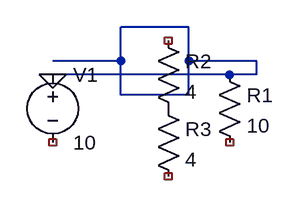
[diagram p0: schematic ltspice_edit.asc]
ltspice_edit.asc, the LTspice schematic file:
Version 4
SHEET 1 880 680
WIRE 208 72 128 72
WIRE 128 112 128 72
WIRE 128 112 48 112
WIRE 208 112 208 72
WIRE 288 112 208 112
WIRE 256 128 48 128
WIRE 288 128 288 112
WIRE 288 128 256 128
WIRE 128 152 128 112
WIRE 208 152 208 112
WIRE 208 152 128 152
FLAG 48 128 0
SYMBOL voltage 48 112 R0
WINDOW 123 0 0 Left 0
WINDOW 39 0 0 Left 0
SYMATTR InstName V1
SYMATTR Value 10
SYMBOL res 240 112 R0
SYMATTR InstName R1
SYMATTR Value 10
SYMBOL res 168 72 R0
SYMATTR InstName R2
SYMATTR Value 4
SYMBOL res 168 152 R0
SYMATTR InstName R3
SYMATTR Value 4

The netlist it stands for:
* ltspice_edit.asc
V1 0 NC_01 10
R1 0 NC_02 10
R2 NC_03 P001 4
R3 P001 NC_04 4
.backanno
.end